# Altium schematic sheet GNSS_RECV.SchDoc
size A4
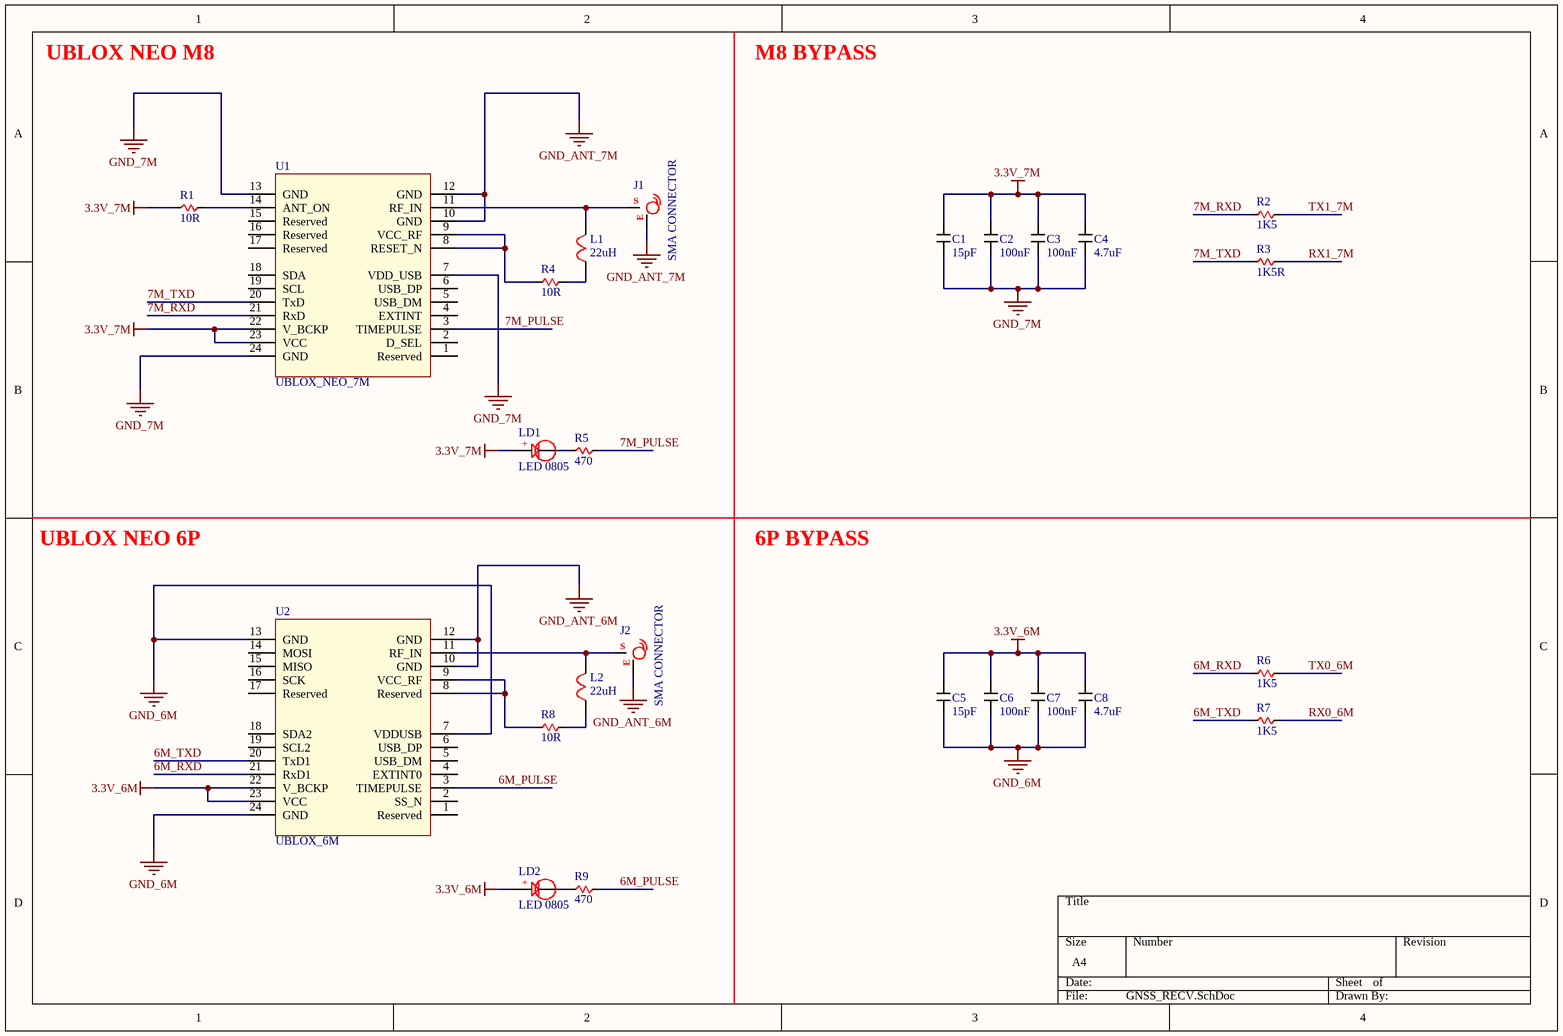
[diagram p0: GNSS_RECV.SchDoc]

## Parts
C1  15pF  [C 0805]
C2  100nF  [C 0805]
C3  100nF  [C 0805]
C4  4.7uF  [C 0805]
C5  15pF  [C 0805]
C6  100nF  [C 0805]
C7  100nF  [C 0805]
C8  4.7uF  [C 0805]
J1  SMA CONNECTOR  [SMA_CONNECTOR]
J2  SMA CONNECTOR  [SMA_CONNECTOR]
L1  22uH  [L 0603]
L2  22uH  [L 0603]
LD1  LED 0805  [LED 0805]
LD2  LED 0805  [LED 0805]
R1  10R  [R 0805]
R2  1K5  [R 0805]
R3  1K5R  [R 0805]
R4  10R  [R 0805]
R5  470  [R 0805]
R6  1K5  [R 0805]
R7  1K5  [R 0805]
R8  10R  [R 0805]
R9  470  [R 0805]
U1  UBLOX_NEO_7M  [UBLOX_M8]
U2  UBLOX_6M  [UBLOX_6P]

## Nets
3.3V_6M: C5.2 C6.2 C7.2 C8.2 LD2.1 U2.22(V_BCKP) U2.23(VCC)
3.3V_7M: C1.2 C2.2 C3.2 C4.2 LD1.1 R1.1 U1.22(V_BCKP) U1.23(VCC)
GND_6M: C5.1 C6.1 C7.1 C8.1 U2.7(VDDUSB) U2.13(GND) U2.24(GND)
GND_7M: C1.1 C2.1 C3.1 C4.1 U1.7(VDD_USB) U1.13(GND) U1.24(GND)
GND_ANT_6M: J2.2 U2.10(GND) U2.12(GND)
GND_ANT_7M: J1.2 U1.10(GND) U1.12(GND)
6M_PULSE: R9.1 U2.3(TIMEPULSE)
6M_RXD: R6.1 U2.21(RxD1)
6M_TXD: R7.1 U2.20(TxD1)
7M_PULSE: R5.1 U1.3(TIMEPULSE)
7M_RXD: R2.1 U1.21(RxD)
7M_TXD: R3.1 U1.20(TxD)
RX0_6M: R7.2
RX1_7M: R3.2
TX0_6M: R6.2
TX1_7M: R2.2
NetJ1_1: J1.1(S) L1.2 U1.11(RF_IN)
NetJ2_1: J2.1(S) L2.2 U2.11(RF_IN)
NetL1_1: L1.1 R4.2
NetL2_1: L2.1 R8.1
NetLD1_2: LD1.2 R5.2
NetLD2_2: LD2.2 R9.2
NetR1_2: R1.2 U1.14(ANT_ON)
NetR4_1: R4.1 U1.8(RESET_N) U1.9(VCC_RF)
NetR8_2: R8.2 U2.8(Reserved) U2.9(VCC_RF)

Not connected (* = marked no-connect by the designer): U1 1(Reserved) 2(D_SEL) 4(EXTINT) 5(USB_DM) 6(USB_DP) 15(Reserved) 16(Reserved) 17(Reserved) 18(SDA) 19(SCL); U2 1(Reserved) 2(SS_N) 4(EXTINT0) 5(USB_DM) 6(USB_DP) 14(MOSI) 15(MISO) 16(SCK) 17(Reserved) 18(SDA2) 19(SCL2)

## Notes on the sheet
- UBLOX NEO M8
- M8 BYPASS
- UBLOX NEO 6P
- 6P BYPASS
- (in symbol ANT_SMA) E
- (in symbol LED 0805) +

## Library data of the parts
C1-C8 = C 0805
J1 J2 = ANT_SMA
L1 L2 = L 0603
R1-R9 = R 0805
U1 = UBLOX_M8
U2 = UBLOX_6P: UBLOX_NEO_6P